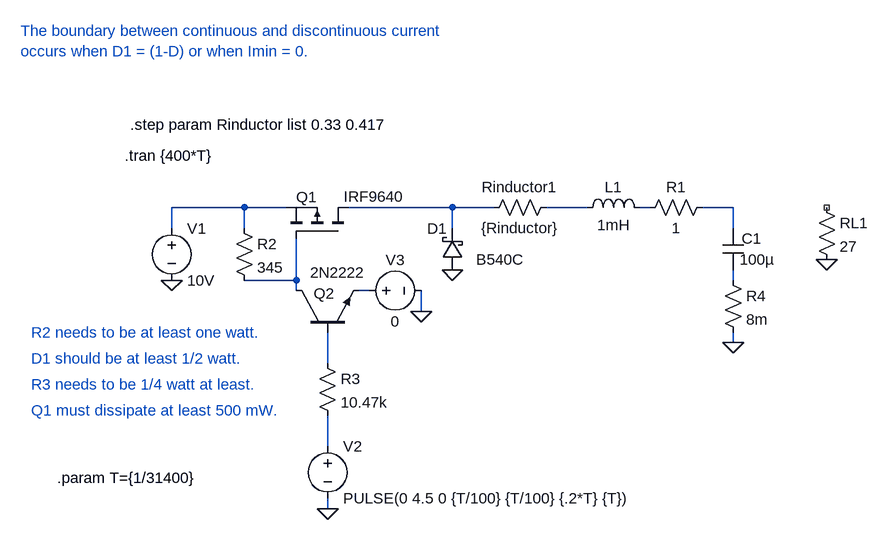
[diagram p0: schematic discontinousmodebuckconv.asc]
discontinousmodebuckconv.asc, the LTspice schematic file:
Version 4
SHEET 1 1104 680
WIRE 144 144 32 144
WIRE 208 144 144 144
WIRE 464 144 304 144
WIRE 528 144 464 144
WIRE 672 144 608 144
WIRE 768 144 752 144
WIRE 896 144 848 144
WIRE 32 176 32 144
WIRE 144 176 144 144
WIRE 464 176 464 144
WIRE 896 176 896 144
WIRE 224 256 224 192
WIRE 224 256 144 256
WIRE 896 256 896 240
WIRE 224 272 224 256
WIRE 336 272 320 272
WIRE 416 304 416 272
WIRE 896 352 896 336
WIRE 272 384 272 336
WIRE 272 512 272 464
WIRE 272 608 272 592
FLAG 1040 224 0
FLAG 896 352 0
FLAG 464 240 0
FLAG 32 256 0
FLAG 272 608 0
FLAG 416 304 0
SYMBOL pmos 304 192 M270
WINDOW 0 64 80 VLeft 2
WINDOW 3 65 7 VLeft 2
SYMATTR InstName Q1
SYMATTR Value IRF9640
SYMBOL voltage 32 160 R0
WINDOW 123 0 0 Left 0
WINDOW 39 0 0 Left 0
SYMATTR InstName V1
SYMATTR Value 10V
SYMBOL schottky 480 240 R180
WINDOW 0 24 64 Left 2
WINDOW 3 -94 16 Left 2
SYMATTR InstName D1
SYMATTR Value B540C
SYMATTR Description Diode
SYMATTR Type diode
SYMBOL ind 656 160 R270
WINDOW 0 32 56 VTop 2
WINDOW 3 5 56 VBottom 2
SYMATTR InstName L1
SYMATTR Value 1mH
SYMATTR SpiceLine Rser=.1
SYMBOL cap 880 176 R0
WINDOW 0 29 16 Left 2
WINDOW 3 26 48 Left 2
SYMATTR InstName C1
SYMATTR Value 100µ
SYMATTR SpiceLine Rser=.1
SYMBOL res 1024 128 R0
SYMATTR InstName RL1
SYMATTR Value 27
SYMBOL voltage 272 496 R0
WINDOW 123 0 0 Left 0
WINDOW 39 0 0 Left 0
SYMATTR InstName V2
SYMATTR Value PULSE(0 4.5 0 {T/100} {T/100} {.2*T} {T})
SYMBOL res 864 128 R90
WINDOW 0 0 56 VBottom 2
WINDOW 3 32 56 VTop 2
SYMATTR InstName R1
SYMATTR Value 1
SYMBOL npn 224 336 R270
WINDOW 0 60 27 VRight 2
WINDOW 3 92 21 VRight 2
SYMATTR InstName Q2
SYMATTR Value 2N2222
SYMBOL res 128 160 R0
SYMATTR InstName R2
SYMATTR Value 345
SYMBOL res 256 368 R0
SYMATTR InstName R3
SYMATTR Value 10.47k
SYMBOL voltage 320 272 R270
WINDOW 0 32 56 VTop 2
WINDOW 3 -32 56 VBottom 2
SYMATTR InstName V3
SYMATTR Value 0
SYMBOL res 624 128 R90
WINDOW 0 0 56 VBottom 2
WINDOW 3 32 56 VTop 2
SYMATTR InstName Rinductor1
SYMATTR Value {Rinductor}
SYMBOL res 880 240 R0
SYMATTR InstName R4
SYMATTR Value 8m
TEXT -144 560 Left 2 !.param T={1/31400}
TEXT -40 64 Left 2 !.tran {400*T}
TEXT -184 336 Left 2 ;R2 needs to be at least one watt.
TEXT -184 376 Left 2 ;D1 should be at least 1/2 watt.
TEXT -184 416 Left 2 ;R3 needs to be 1/4 watt at least.
TEXT -184 456 Left 2 ;Q1 must dissipate at least 500 mW.
TEXT -32 16 Left 2 !.step param Rinductor list 0.33 0.417
TEXT -200 -128 Left 2 ;The boundary between continuous and discontinuous current\noccurs when D1 = (1-D) or when Imin = 0.

The netlist it stands for:
* discontinousmodebuckconv.asc
M§Q1 N002 N006 N001 N001 IRF9640
V1 N001 0 10V
D1 0 N002 B540C
L1 N003 N004 1mH Rser=.1
C1 N005 N007 100µ Rser=.1
RL1 NC_01 0 27
V2 N010 0 PULSE(0 4.5 0 {T/100} {T/100} {.2*T} {T})
R1 N005 N004 1
Q2 N006 N009 N008 0 2N2222
R2 N001 N006 345
R3 N009 N010 10.47k
V3 N008 0 0
Rinductor1 N003 N002 {Rinductor}
R4 N007 0 8m
.model D D
.lib standard.dio
.model NPN NPN
.model PNP PNP
.lib standard.bjt
.model NMOS NMOS
.model PMOS PMOS
.lib standard.mos
.param T={1/31400}
.tran {400*T}
* R2 needs to be at least one watt.
* D1 should be at least 1/2 watt.
* R3 needs to be 1/4 watt at least.
* Q1 must dissipate at least 500 mW.
.step param Rinductor list 0.33 0.417
* The boundary between continuous and discontinuous current
* occurs when D1 = (1-D) or when Imin = 0.
.backanno
.end